# EAGLE design DriverEchar (EAGLE 9.0.1)
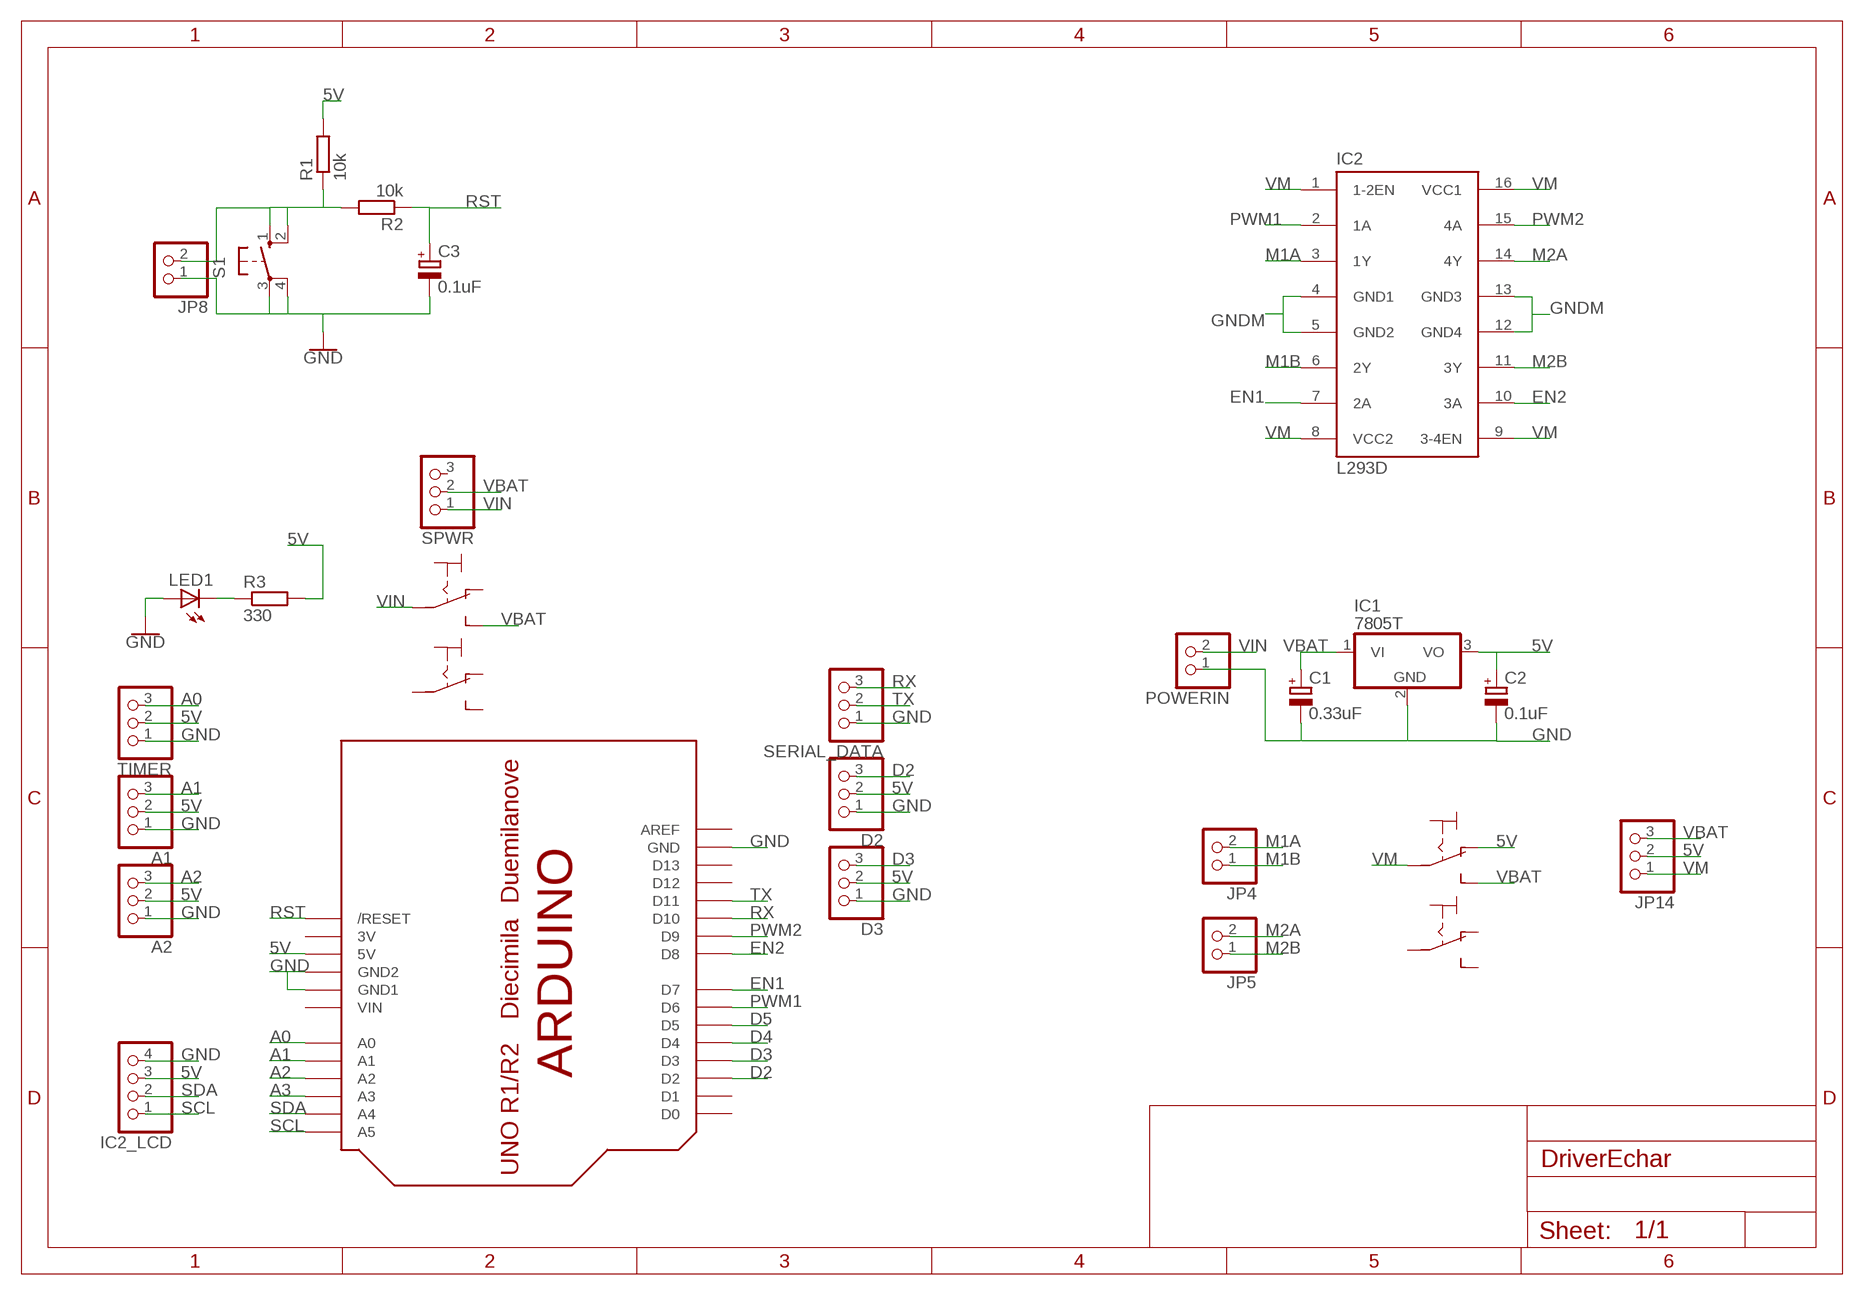
[diagram p0: schematic, sheet 1]

## Parts
A1  PINHD-1X3  [1X03]
A2  PINHD-1X3  [1X03]
C1  0.33uF  CPOL-EUE2.5-6  [E2,5-6]
C2  0.1uF  CPOL-EUE2.5-6  [E2,5-6]
C3  0.1uF  CPOL-EUE2.5-6  [E2,5-6]
D2  PINHD-1X3  [1X03]
D3  PINHD-1X3  [1X03]
IC1  7805T  [TO220H]
IC2  L293D  [DIL16]
IC2_LCD  PINHD-1X4  [1X04]
JP4  PINHD-1X2  [1X02]
JP5  PINHD-1X2  [1X02]
JP8  PINHD-1X2  [1X02]
JP14  PINHD-1X3  [1X03]
LED1  LED3MM  [LED3MM]
POWERIN  PINHD-1X2  [1X02]
R1  10k  R-EU_0207/10  [0207/10]
R2  10k  R-EU_0207/10  [0207/10]
R3  330  R-EU_0207/10  [0207/10]
S1  10-XX  [B3F-10XX]
SERIAL_DATA  PINHD-1X3  [1X03]
SPWR  PINHD-1X3  [1X03]
TIMER  PINHD-1X3  [1X03]
U$1  ARDUINO-BPLACE  [ARDUINO-BPLACE]
U$2  MICROSWITCH_2X3  [MICROSWITCH_2X3]
U$3  MICROSWITCH_2X3  [MICROSWITCH_2X3]

## Nets
5V: A1.2 A2.2 C2.+ D2.2 D3.2 IC1.3(VO) IC2_LCD.3 JP14.2 R1.2 R3.2 TIMER.2 U$1.5V U$2.NC1
A0: TIMER.3 U$1.A0
A1: A1.3 U$1.A1
A2: A2.3 U$1.A2
A3: U$1.A3
D2: D2.3 U$1.D2
D3: D3.3 U$1.D3
D4: U$1.D4
D5: U$1.D5
EN1: IC2.7(2A) U$1.D7
EN2: IC2.10(3A) U$1.D8
GND: A1.1 A2.1 C1.- C2.- C3.- D2.1 D3.1 IC1.2(GND) IC2_LCD.4 JP8.1 LED1.A POWERIN.1 S1.3(P) S1.4(P1) SERIAL_DATA.1 TIMER.1 U$1.GND U$1.GND1 U$1.GND2
GNDM: IC2.4(GND1) IC2.5(GND2) IC2.12(GND4) IC2.13(GND3)
M1A: IC2.3(1Y) JP4.2
M1B: IC2.6(2Y) JP4.1
M2A: IC2.14(4Y) JP5.2
M2B: IC2.11(3Y) JP5.1
N$2: JP8.2 R1.1 R2.2 S1.1(S) S1.2(S1)
N$4: LED1.K(C) R3.1
PWM1: IC2.2(1A) U$1.D6
PWM2: IC2.15(4A) U$1.D9
RST: C3.+ R2.1 U$1.RESET(/RESET)
RX: SERIAL_DATA.3 U$1.D10
SCL: IC2_LCD.1 U$1.A5
SDA: IC2_LCD.2 U$1.A4
TX: SERIAL_DATA.2 U$1.D11
VBAT: C1.+ IC1.1(VI) JP14.3 SPWR.2 U$2.NO1 U$3.NO1
VIN: POWERIN.2 SPWR.1 U$3.C1(COM1)
VM: IC2.1(1-2EN) IC2.8(VCC2) IC2.9(3-4EN) IC2.16(VCC1) JP14.1 U$2.C1(COM1)
Unconnected: SPWR.3 U$1.AREF U$1.D0 U$1.D1 U$1.D12 U$1.D13 U$2.C2(COM2) U$2.NC2 U$2.NO2 U$3.C2(COM2) U$3.NC1 U$3.NC2 U$3.NO2

## Power pins joined to a net without a drawn wire
3V: U$1.3V
VIN: U$1.VIN

## Library data of the parts
A1 A2 D2 D3 JP14 SERIAL_DATA SPWR TIMER = pinhead:PINHD-1X3: PIN HEADER
C1-C3 = rcl:CPOL-EU: POLARIZED CAPACITOR, European symbol; SPICEPREFIX: C
IC1 = linear:78*: Positive VOLTAGE REGULATOR Source: http://cache.national.com/ds/LM/LM78L05.pdf http://www.fairchildsemi.com/ds/LM/LM7805.pdf
IC2 = st-microelectronics:L293D: PUSH-PULL 4 CHANNEL DRIVER; MPN: L293D; OC_FARNELL: 9589619; OC_NEWARK: 56P8249
IC2_LCD = pinhead:PINHD-1X4: PIN HEADER
JP4 JP5 JP8 POWERIN = pinhead:PINHD-1X2: PIN HEADER
LED1 = led:LED: LED OSRAM: - CHIPLED LG R971, LG N971, LY N971, LG Q971, LY Q971, LO R971, LY R971 LH N974, LH R974 LS Q976, LO Q976, LY Q976 LO Q996 - Hyper CHIPLED LW Q18S LB Q993, LB Q99A, LB R99A - SideLED LS A670, LO A670, LY A670, LG A670, LP A670 LB A673, LV A673, LT A673, LW A673 LH A674 LY A675 LS A676, LA A676, LO A676, LY A676, LW A676 LS A679, LY A679, LG A679 - Hyper Micro SIDELED® LS Y876, LA Y876, LO Y876, LY Y876 LT Y87S - SmartLED LW L88C, LW L88S LB L89C, LB L89S, LG L890 LS L89K, LO L89K, LY L89K LS L896, LA L896, LO L896, LY L896 - TOPLED LS T670, LO T670, LY T670, LG T670, LP T670 LSG T670, LSP T670, LSY T670, LOP T670, LYG T670 LG T671, LOG T671, LSG T671 LB T673, LV T673, LT T673, LW T673 LH T674 LS T676, LA T676, LO T676, LY T676, LB T676, LH T676, LSB T676, LW T676 LB T67C, LV T67C, LT T67C, LS T67K, LO T67K, LY T67K, LW E67C LS E67B, LA E67B, LO E67B, LY E67B, LB E67C, LV E67C, LT E67C LW T67C LS T679, LY T679, LG T679 LS T770, LO T770, LY T770, LG T770, LP T770 LB T773, LV T773, LT T773, LW T773 LH T774 LS E675, LA E675, LY E675, LS T675 LS T776, LA T776, LO T776, LY T776, LB T776 LHGB T686 LT T68C, LB T68C - Hyper Mini TOPLED® LB M676 - Mini TOPLED Santana® LG M470 LS M47K, LO M47K, LY M47K Source: http://www.osram.convergy.de LUXEON: - LUMILED® LXK2-PW12-R00, LXK2-PW12-S00, LXK2-PW14-U00, LXK2-PW14-V00 LXK2-PM12-R00, LXK2-PM12-S00, LXK2-PM14-U00 LXK2-PE12-Q00, LXK2-PE12-R00, LXK2-PE12-S00, LXK2-PE14-T00, LXK2-PE14-U00 LXK2-PB12-K00, LXK2-PB12-L00, LXK2-PB12-M00, LXK2-PB14-N00, LXK2-PB14-P00, LXK2-PB14-Q00 LXK2-PR12-L00, LXK2-PR12-M00, LXK2-PR14-Q00, LXK2-PR14-R00 LXK2-PD12-Q00, LXK2-PD12-R00, LXK2-PD12-S00 LXK2-PH12-R00, LXK2-PH12-S00 LXK2-PL12-P00, LXK2-PL12-Q00, LXK2-PL12-R00 Source: www.luxeon.com KINGBRIGHT: KA-3528ASYC Source: www.kingbright.com
R1-R3 = rcl:R-EU_: RESISTOR, European symbol; SPICEPREFIX: R
S1 = switch-omron:10-XX: OMRON SWITCH; MPN: B3F-1000; OC_FARNELL: 176432; OC_NEWARK: 36M3542
U$1 = adafruit:ARDUINO: Arduino Diecimila/Duemilanove Make a shield with ease, this package has all the named pins as well as the two mounting drill holes and an outline of the USB and DC power connector. The outline is on the DIMENSION layer, so if your board house uses it they will cut the outline to match. http://www.ladyada.net/library/pcb/eaglelibrary.html
U$2 U$3 = custom:MICROSWITCH_2X3

## Board
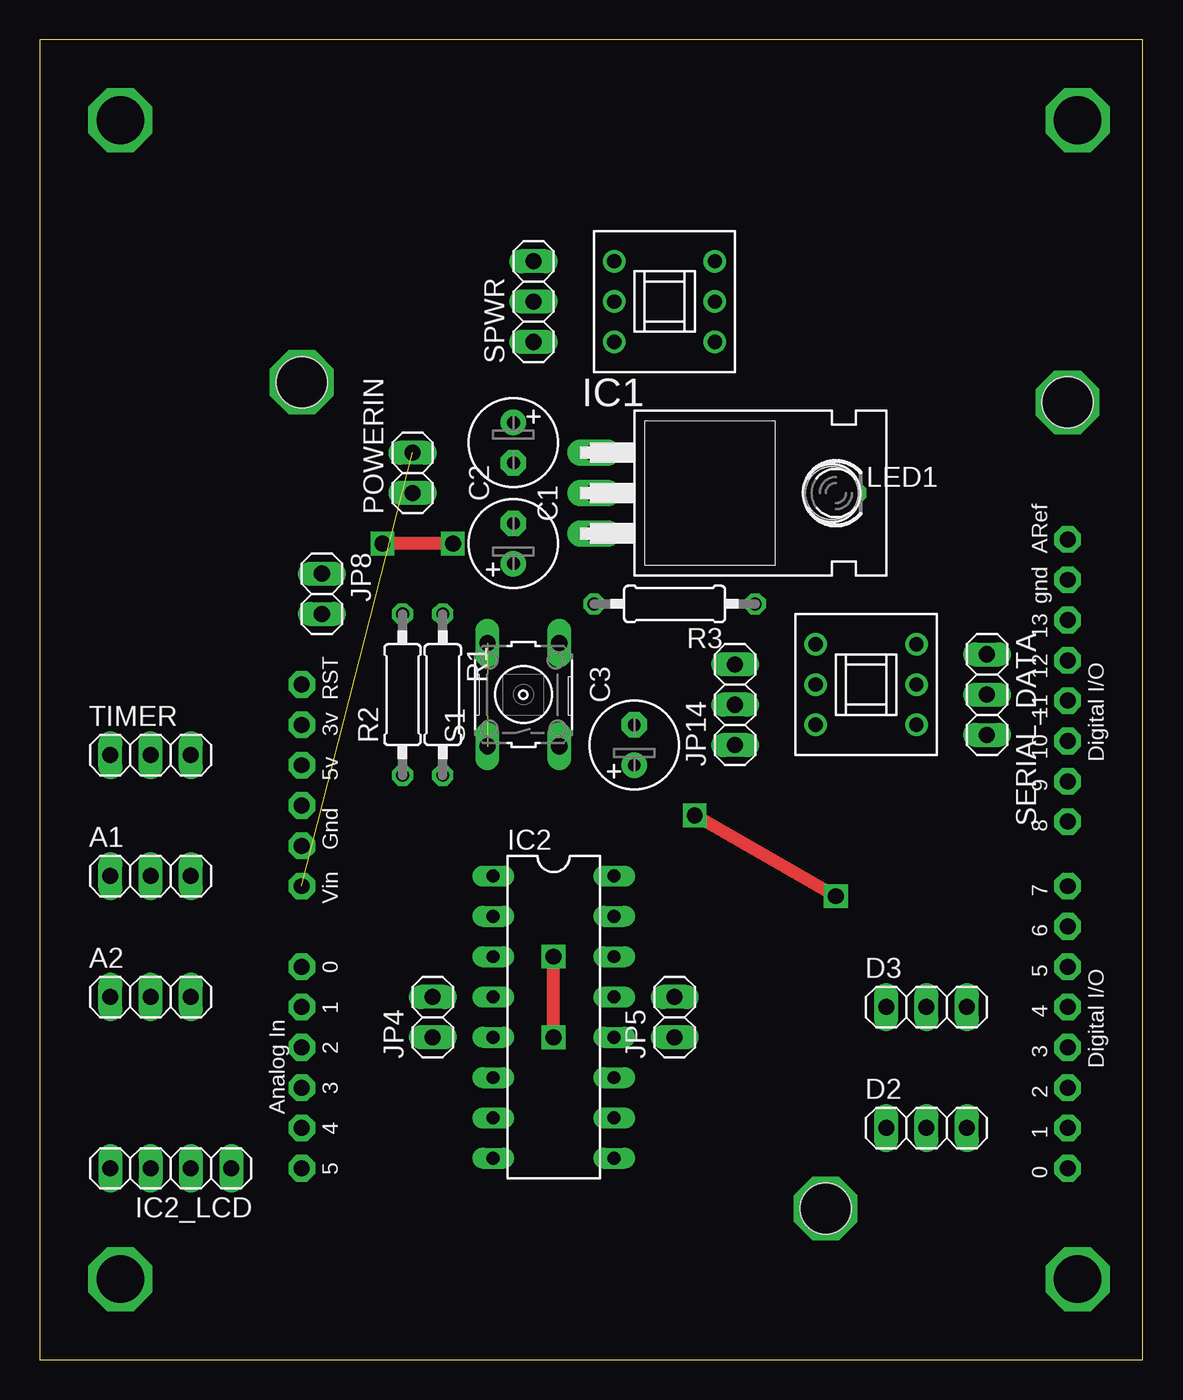
[diagram p1: board, top side]
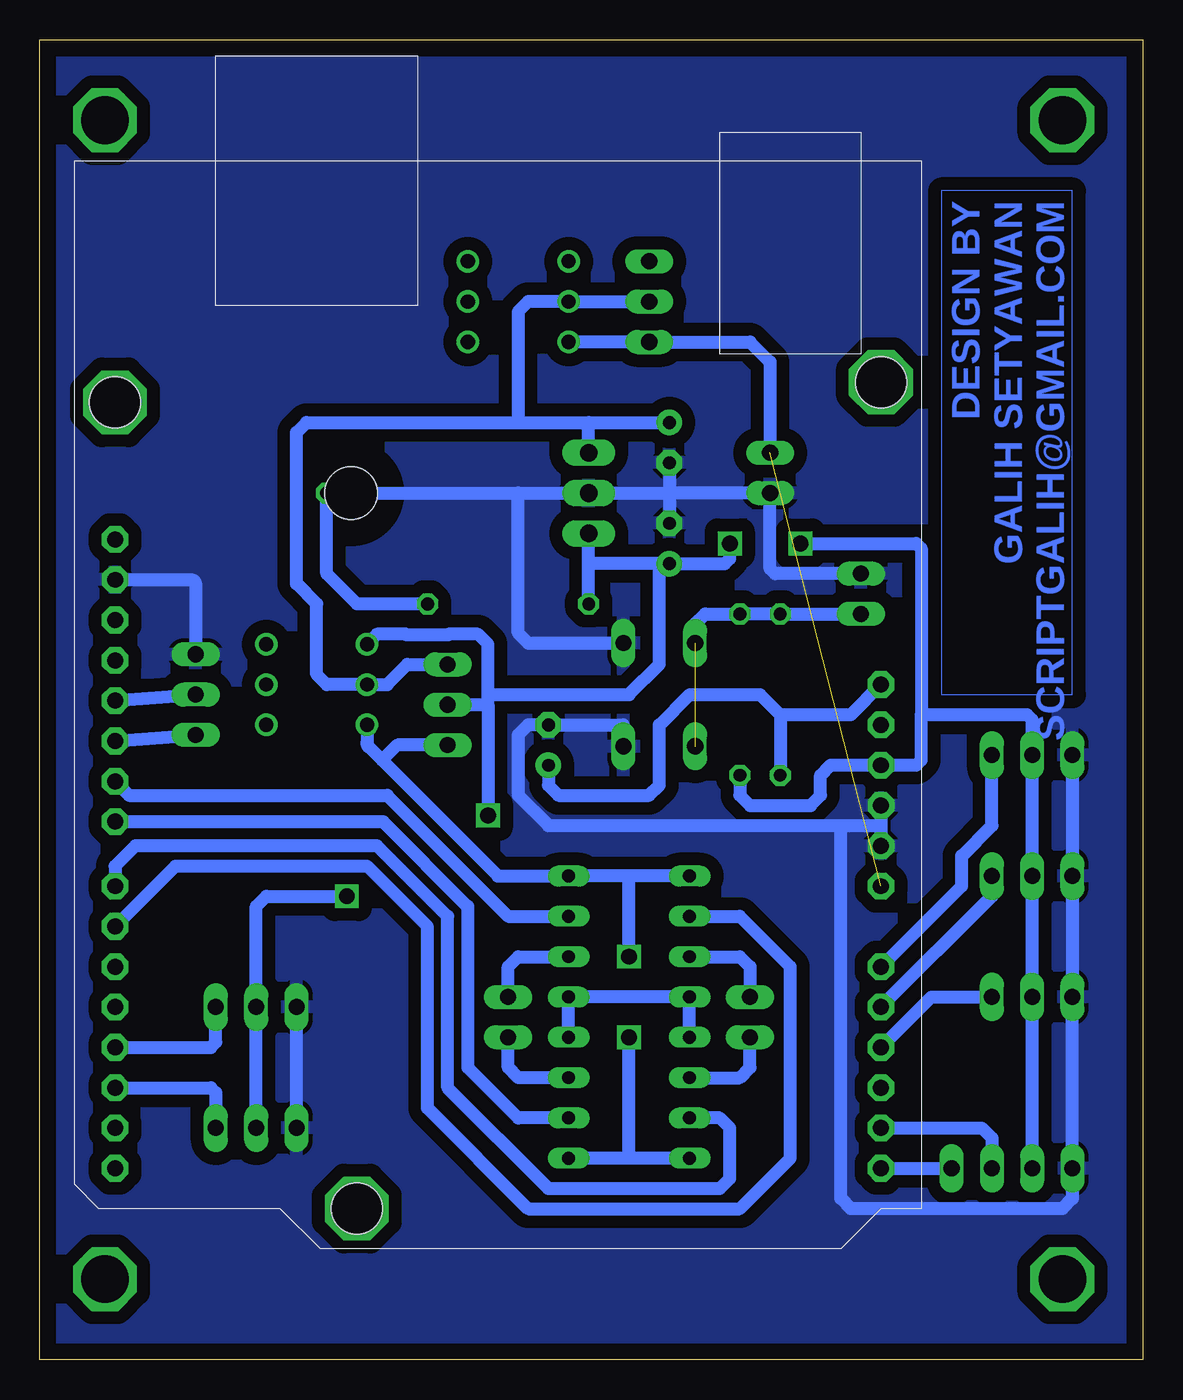
[diagram p2: board, bottom side, seen from below]

Size 69.52 x 83.17 mm. Coordinates in mm from the lower left corner, seen from the top.
Outline: 0,0 69.52,0 69.52,83.17 0,83.17 0,0
Copper layers (1*16): Top 0.035mm / dielectric 1.5mm / Bottom 0.035mm
Design rules "default": minimum track width 6mil, minimum drill 0.35mm, track to track 6mil, track to pad 6mil, pad to pad 6mil, via to via 6mil, smd to smd 6mil, copper to edge 40mil, drill to drill 6mil, minimum pad ring 10mil, minimum via ring 8mil, stop-mask expansion 4mil, vias tented up to drill 0mil, thermal gap 10mil

### Footprints (pad centres in the part's own frame; a part is rotated, then mirrored left to right if it is on the bottom)
1X03 = drill 1.016 long: 1 -2.54,0; 2 0,0; 3 2.54,0
E2,5-6 = drill 0.813 pad 1.6: + -1.27,0 | drill 0.813 pad 1.6 octagon: - 1.27,0
TO220H = drill 1.118 long: 1 -2.54,-10.16; 2 0,-10.16; 3 2.54,-10.16 | hole 3.302: 0,4.826
DIL16 = drill 0.813 long: 1 -8.89,-3.81; 2 -6.35,-3.81; 3 -3.81,-3.81; 4 -1.27,-3.81; 5 1.27,-3.81; 6 3.81,-3.81; 7 6.35,-3.81; 8 8.89,-3.81; 9 8.89,3.81; 10 6.35,3.81; 11 3.81,3.81; 12 1.27,3.81; 13 -1.27,3.81; 14 -3.81,3.81; 15 -6.35,3.81; 16 -8.89,3.81
1X04 = drill 1.016 long: 1 -3.81,0; 2 -1.27,0; 3 1.27,0; 4 3.81,0
1X02 = drill 1.016 long: 1 -1.27,0; 2 1.27,0
LED3MM = drill 0.813 octagon: A -1.27,0; K 1.27,0
0207/10 = drill 0.813 octagon: 1 -5.08,0; 2 5.08,0
B3F-10XX = drill 1.016 long: 1 -3.251,2.261; 2 3.251,2.261; 3 -3.251,-2.261; 4 3.251,-2.261
ARDUINO-BPLACE = drill 1 pad 1.676 octagon: 3V 35.56,2.54; 5V 38.1,2.54; A0 50.8,2.54; A1 53.34,2.54; A2 55.88,2.54; A3 58.42,2.54; A4 60.96,2.54; A5 63.5,2.54; AREF 23.876,50.8; D0 63.5,50.8; D1 60.96,50.8; D2 58.42,50.8; D3 55.88,50.8; D4 53.34,50.8; D5 50.8,50.8; D6 48.26,50.8; D7 45.72,50.8; D8 41.656,50.8; D9 39.116,50.8; D10 36.576,50.8; D11 34.036,50.8; D12 31.496,50.8; D13 28.956,50.8; GND 26.416,50.8; GND1 43.18,2.54; GND2 40.64,2.54; RESET 33.02,2.54; VIN 45.72,2.54 | hole 3.2: 15.24,50.8; 66.04,35.56; 13.97,2.54
MICROSWITCH_2X3 = drill 0.9 pad 1.422: C1 1.27,2.54; C2 7.62,7.62; NC1 1.27,7.62; NC2 7.62,2.54; NO1 1.27,5.08; NO2 7.62,5.08

### Placement (x,y rotation side)
A1  6.98,30.48 0 top
A2  6.98,22.86 0 top
C1  29.85,57.78 270 top
C2  29.85,51.44 90 top
C3  37.46,38.73 90 top
D2  55.88,14.6 0 top
D3  55.88,22.22 0 top
IC1  45.09,54.61 270 top
IC2  32.38,21.59 270 top
IC2_LCD  8.26,12.06 180 top
JP4  24.76,21.59 90 top
JP5  40.01,21.59 90 top
JP8  17.78,48.26 270 top
JP14  43.82,41.27 90 top
LED1  50.16,54.61 0 top
POWERIN  23.49,55.88 90 top
R1  25.4,41.91 270 top
R2  22.86,41.91 90 top
R3  40.01,47.62 180 top
S1  30.48,41.91 90 top
SERIAL_DATA  59.69,41.91 270 top
SPWR  31.12,66.67 90 top
TIMER  6.98,38.1 0 top
U$1  13.97,75.56 270 top
U$2  47.62,37.47 0 top
U$3  34.93,61.59 0 top

### Tracks (layer width: path | path; a pad name or v marks a point on that pad's centre or on a via)
5V  (via drill 1 pad 1.3)
  Top 0.813: v26.04,51.44 v21.59,51.44 | v50.16,29.21 v41.27,34.29
  Bottom 0.813: R1.2 25.4,35.56 24.76,34.92 20.96,34.92 20.32,35.56 20.32,36.83 19.68,37.47 U$1.5V 14.29,37.47 13.97,37.78 13.97,40.64 | 34.93,50.16 IC1.3 | 30.48,50.16 C2.+ 26.35,50.16 26.04,50.48 v26.04,51.44 | 30.48,50.16 34.93,50.16 | R3.2 34.93,50.16 | U$2.NC1 48.26,45.72 46.41,45.72 46.41,45.67 43.76,45.67 43.76,45.72 41.91,45.72 41.27,45.08 41.27,41.91 | 41.27,41.27 41.27,41.91 | JP14.2 41.27,41.27 | 41.27,41.91 32.38,41.91 30.48,43.81 30.48,50.16 | D2.2 D3.2 55.88,28.58 55.24,29.21 v50.16,29.21 | IC2_LCD.3 A2.2 A1.2 TIMER.2 6.98,40.32 7.3,40.64 13.97,40.64 | v21.59,51.44 14.29,51.44 13.97,51.12 13.97,40.64 | 41.27,41.27 v41.27,34.29
A0
  Bottom 0.813: U$1.A0 11.43,29.84 11.43,31.75 9.52,33.66 TIMER.3
A1
  Bottom 0.813: A1.3 9.52,29.21 U$1.A1
A2
  Bottom 0.813: U$1.A2 13.34,22.86 A2.3
D2
  Bottom 0.813: U$1.D2 58.74,17.14 58.42,16.83 D2.3
D3
  Bottom 0.813: U$1.D3 58.74,19.69 58.42,20 D3.3
EN1
  Bottom 0.813: IC2.7 26.67,15.24 26.04,14.6 26.04,11.43 26.67,10.79 37.46,10.79 43.82,17.14 43.82,27.94 48.26,32.38 63.5,32.38 64.77,31.11 U$1.D7
EN2
  Bottom 0.813: U$1.D8 47.88,33.91 42.54,28.58 42.54,18.41 39.37,15.24 IC2.10
GND
  Bottom 0.813: U$1.GND2 16.51,33.66 | 16.51,33.66 U$1.GND1 | S1.4 38.73,45.16 39.37,45.8 39.37,54.61 | C1.- 29.85,54.61 | 29.85,54.61 C2.- | 29.85,54.61 IC1.2 39.37,54.61 | LED1.A 39.37,54.61 | 19.05,33.66 16.51,33.66 | 19.05,33.66 19.05,10.16 18.41,9.52 5.08,9.52 4.45,10.16 IC2_LCD.4 A2.1 4.45,23.49 A1.1 TIMER.1 | U$1.GND 60.01,49.15 arc90 59.69,48.83 SERIAL_DATA.1 | 19.05,33.66 37.46,33.66 39.37,35.56 39.37,39.37 38.73,40 C3.- 32.74,40 S1.3 | JP8.1 23.18,49.53 23.49,49.85 POWERIN.1 29.85,54.61 | D2.1 D3.1
  pour Bottom (isolate 0.813): 1.27,1.27 1.27,81.91 68.58,81.91 68.58,1.27
GNDM
  Bottom 0.813: IC2.5 IC2.4 IC2.13 IC2.12
M1A
  Bottom 0.813: IC2.3 25.4,25.4 24.76,24.77 JP4.2
M1B
  Bottom 0.813: IC2.6 25.4,17.78 24.76,18.41 JP4.1
M2A
  Bottom 0.813: JP5.2 40.01,24.77 39.37,25.4 IC2.14
M2B
  Bottom 0.813: IC2.11 39.37,17.78 40.01,18.41 JP5.1
N$1  (via drill 3 pad 1.5)
  other vias: 16.51,61.59
N$2  (1 unrouted)
  Bottom 0.813: S1.2 28.22,46.36 27.58,46.99 R1.1 R2.2 JP8.2
N$3  (via drill 3 pad 1.5)
  other vias: 64.77,60.33
N$4
  Bottom 0.813: R3.1 49.53,47.62 51.43,49.53 LED1.K
N$5  (via drill 3 pad 1.5)
  other vias: 49.53,9.52
N$6  (via drill 3 pad 3.3)
  other vias: 5.08,78.11
N$7  (via drill 3 pad 3.3)
  other vias: 65.41,78.11
N$8  (via drill 3 pad 3.3)
  other vias: 5.08,5.08
N$9  (via drill 3 pad 3.3)
  other vias: 65.41,5.08
N$10
  Bottom 0.076: 12.7,41.91 4.45,41.91 4.45,73.66 12.7,73.66 12.7,41.91
PWM1
  Bottom 0.813: U$1.D6 60.96,31.11 48.9,31.11 45.09,27.3 45.09,15.88 38.73,9.52 25.4,9.52 22.23,12.7 22.23,24.77 25.4,27.94 IC2.2
PWM2
  Bottom 0.813: IC2.15 40.01,27.94 47.62,35.56 63.88,35.56 U$1.D9
RST
  Bottom 0.813: C3.+ 37.46,36.19 36.83,35.56 31.12,35.56 30.48,36.19 30.48,40 28.57,41.91 24.13,41.91 22.86,40.64 | 22.86,40.64 R2.1 | 22.86,40.64 18.41,40.64 U$1.RESET
RX
  Bottom 0.813: U$1.D10 SERIAL_DATA.3
SCL
  Bottom 0.813: U$1.A5 IC2_LCD.1
SDA
  Bottom 0.813: U$1.A4 10.16,14.6 9.52,13.97 IC2_LCD.2
TX
  Bottom 0.813: U$1.D11 SERIAL_DATA.2
VBAT
  Bottom 0.813: 39.37,59.05 34.93,59.05 | 34.93,59.05 C1.+ | IC1.1 34.93,59.05 | JP14.3 46.35,43.81 47.62,42.55 U$2.NO1 51.43,42.55 52.07,43.18 52.07,47.62 53.34,48.89 53.34,58.42 52.71,59.05 39.37,59.05 | SPWR.2 U$3.NO1 38.73,66.67 39.37,66.04 39.37,59.05
VIN  (1 unrouted)
  Bottom 0.813: U$3.C1 SPWR.1 24.76,64.13 23.49,62.86 POWERIN.2
VM  (via drill 1 pad 1.5)
  Top 0.813: v32.38,20.32 v32.38,25.4
  Bottom 0.813: IC2.8 32.38,12.7 | 32.38,12.7 IC2.9 | IC2.1 32.38,30.48 | 32.38,30.48 IC2.16 40.64,30.48 47.94,37.78 | 32.38,12.7 v32.38,20.32 | v32.38,25.4 32.38,30.48 | 47.94,37.78 48.8,38.64 arc45 48.9,38.87 U$2.C1 | JP14.1 46.99,38.73 47.94,37.78

### Text on the board
Bottom: DESIGN BY / GALIH SETYAWAN / SCRIPTGALIH@GMAIL.COM